# EasyEDA Pro project 限位开关转接板.eprj

# Schematic 原理图

## Sheets
1 主控MCU: Board Name: esp32; Create Date: 2024-04-22; Page Name: 主控MCU; Project Name: 3轴6.1--esp32; Schematic Name: 原理图; Update Date: 2025-05-09; Company: 嘉立创EDA; Page Size: A3; Version: V1.0
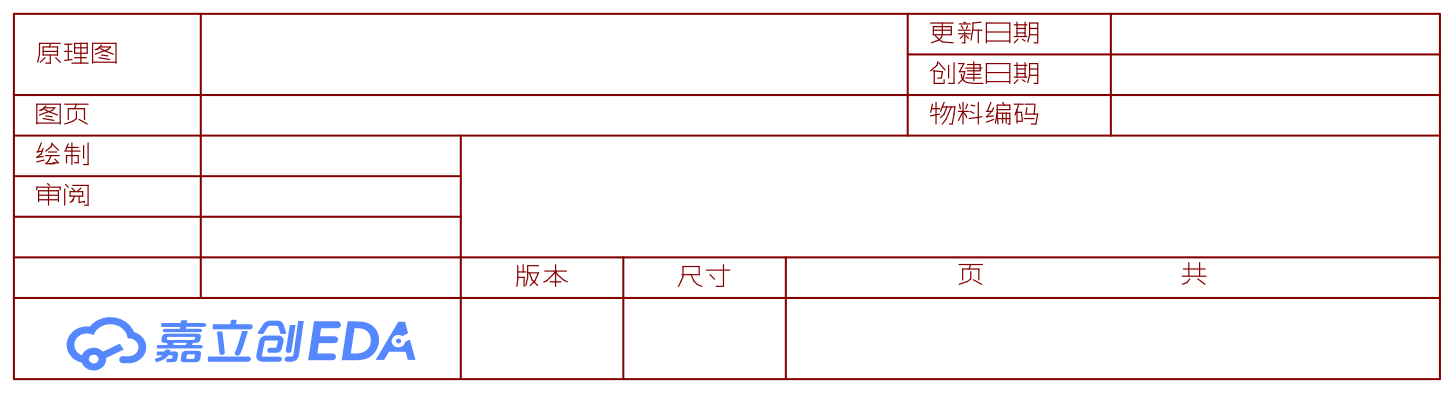
[diagram p0: 主控MCU]
2 电源: Create Date: 2025-05-14; Page Name: 电源; Update Date: 2025-05-14
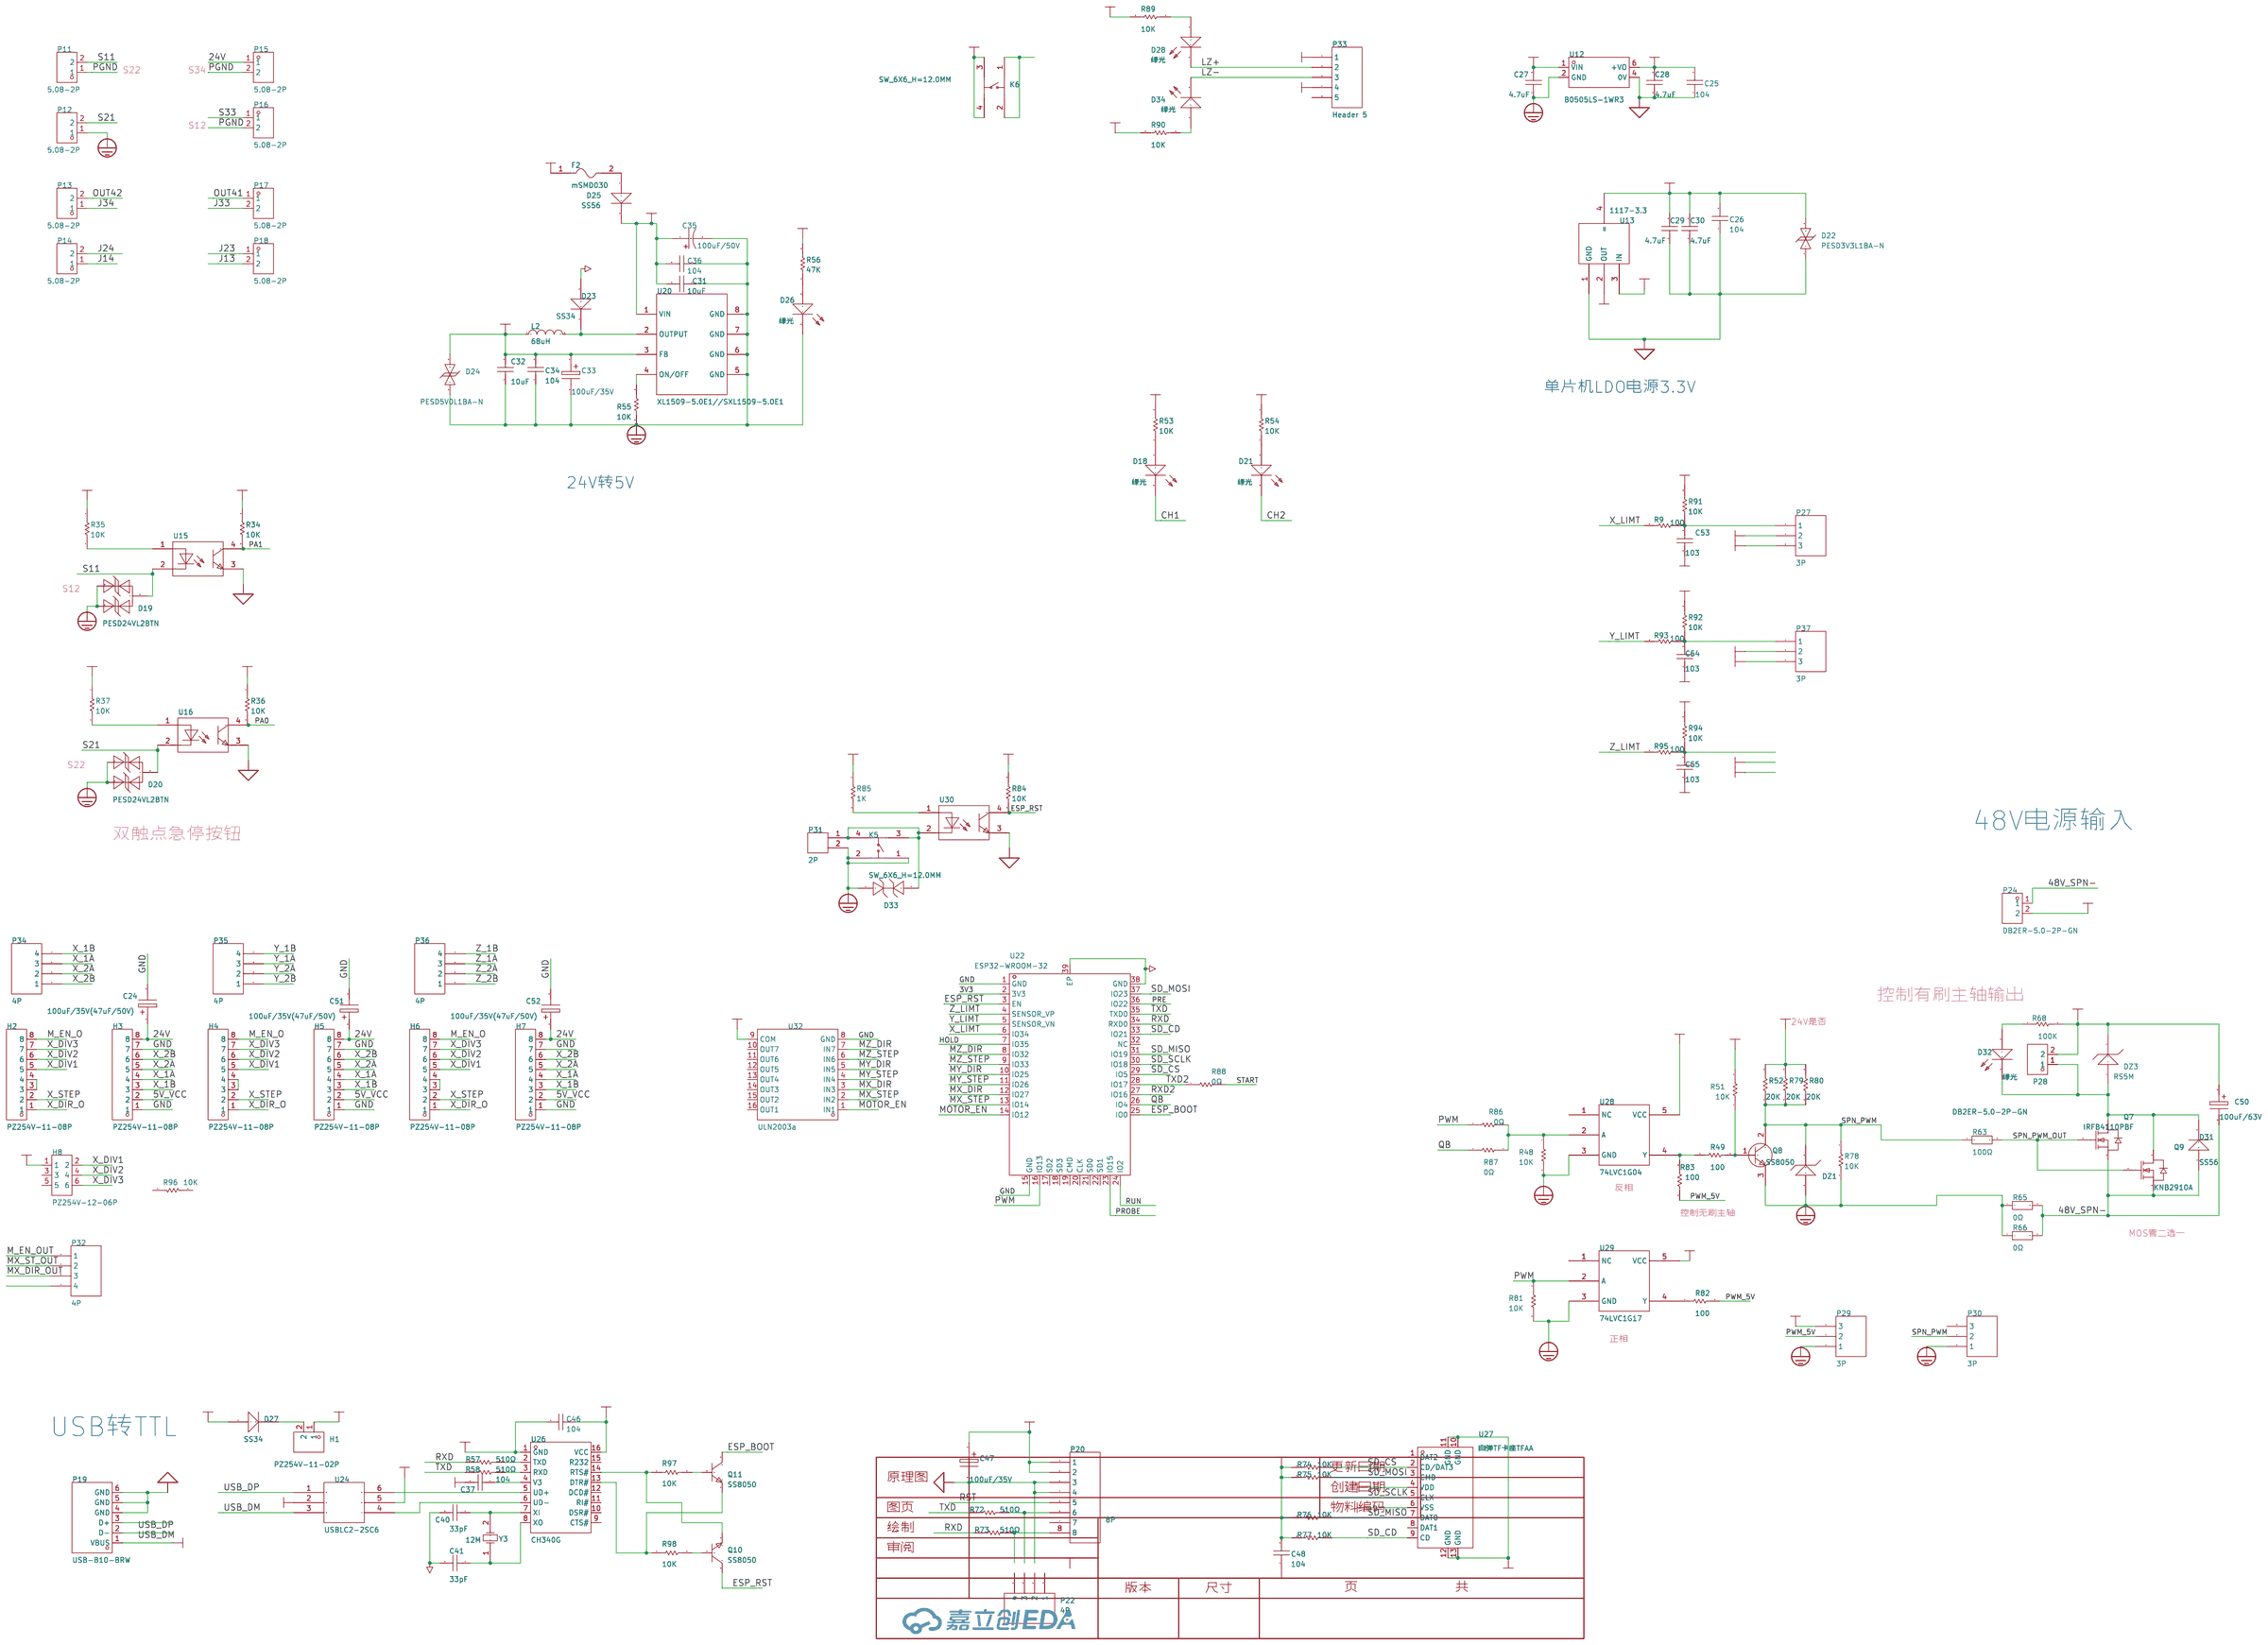
[diagram p1: 电源]

## Parts
C24  100uF/35V(47uF/50V)  [电解电容贴片6X6]
C25  104  [C0603]
C26  104  [0603C]
C27  4.7uF  [C1206]
C28  4.7uF  [C1206]
C29  4.7uF  [C1206]
C30  4.7uF  [C1206]
C31  10uF  [C1206]
C32  10uF  [C1206]
C33  100uF/35V  [电解电容贴片6X6]
C34  104  [0603C]
C35  100uF/50V  [CAP-SMD_BD10.0-L10.3-W10.3-LS11.0-R-RD]
C36  104  [0603C]
C37  104  [0603C]
C40  18pF  [0603C]
C41  18pF  [0603C]
C46  104  [0603C]
C47  100uF/35V  [电解电容贴片6X6]
C48  104  [11]
C50  100uF/63V  [电解电容贴片10x10]
C51  100uF/35V(47uF/50V)  [电解电容贴片6X6]
C52  100uF/35V(47uF/50V)  [电解电容贴片6X6]
C53  103  [11]
C54  103  [11]
C55  103  [11]
D18  绿光  [0603LED]
D19  PESD24VL2BTN  [SOT-23-3_L2.9-W1.6-P1.90-LS2.8-BR]
D20  PESD24VL2BTN  [SOT-23-3_L2.9-W1.6-P1.90-LS2.8-BR]
D21  绿光  [0603LED]
D22  PESD3V3L1BA-N  [SOD-323_L1.8-W1.3-LS2.5-BI]
D23  SS34  [SMA]
D24  PESD5V0L1BA-N  [SOD-323_L1.8-W1.3-LS2.5-BI]
D25  SS56  [SMA]
D26  绿光  [0603LED]
D27  SS34  [SMA]
D28  绿光  [0603LED]
D31  SS56  [SMA]
D32  绿光  [0603LED]
D33  ESD05V52D-C  [SOD-523_L1.2-W0.8-LS1.6-BI]
D34  绿光  [0603LED]
DZ1  --ѹ------SMAZ10V  [SMA]
DZ3  RS5M  [SMC]
F2  mSMD030  [F1812]
H1  PZ254V-11-02P  [HDR-TH_2P-P2.54-V-M]
H2  PZ254V-11-08P  [HDR-TH_8P-P2.54-V-M]
H3  PZ254V-11-08P  [HDR-TH_8P-P2.54-V-M]
H4  PZ254V-11-08P  [HDR-TH_8P-P2.54-V-M]
H5  PZ254V-11-08P  [HDR-TH_8P-P2.54-V-M]
H6  PZ254V-11-08P  [HDR-TH_8P-P2.54-V-M]
H7  PZ254V-11-08P  [HDR-TH_8P-P2.54-V-M]
H8  PZ254V-12-06P  [HDR-TH_PZ254V-12-06P-A40]
K5  SW_6X6_H=12.0MM  [KEY-SMD_4P-L6.0-W6.0-P4.50-LS9.0]
K6  SW_6X6_H=12.0MM  [KEY-SMD_4P-L6.0-W6.0-P4.50-LS9.0]
L2  68uH  [IND-SMD_L7.0-W7.0_SMDRI74-330MT]
P11  5.08-2P  [CONN-TH_2P-P5.08_DB128L-5.08-2P]
P12  5.08-2P  [CONN-TH_2P-P5.08_DB128L-5.08-2P]
P13  5.08-2P  [CONN-TH_2P-P5.08_DB128L-5.08-2P]
P14  5.08-2P  [CONN-TH_2P-P5.08_DB128L-5.08-2P]
P15  5.08-2P  [CONN-TH_2P-P5.08_DB128L-5.08-2P]
P16  5.08-2P  [CONN-TH_2P-P5.08_DB128L-5.08-2P]
P17  5.08-2P  [CONN-TH_2P-P5.08_DB128L-5.08-2P]
P18  5.08-2P  [CONN-TH_2P-P5.08_DB128L-5.08-2P]
P19  USB-B10-BRW  [USB-B-TH_USB-B10-BRW]
P20  8P  [IDC8]
P22  4P  [HDR1X4_CON]
P24  DB2ER-5.0-2P-GN  [CONN-TH_2P-P5.00_DB2ER-5.0-2P-GN]
P27  3P  [HDR1X3_CON]
P28  DB2ER-5.0-2P-GN  [CONN-TH_2P-P5.00_DB2ER-5.0-2P-GN]
P29  3P  [HDR1X3_CON]
P30  3P  [HDR1X3_CON]
P31  2P  [HDR1X2_CON]
P32  4P  [HDR1X4_CON]
P33  Header 5  [HDR1X5_CON]
P34  4P  [HDR1X4_CON]
P35  4P  [HDR1X4_CON]
P36  4P  [HDR1X4_CON]
P37  3P  [HDR1X3_CON]
Q7  IRFB4110PBF  [TO-220-3_L10.0-W4.5-P2.54-L]
Q8  SS8050  [SOT-23]
Q9  KNB2910A  [TO-263-2_L10.0-W9.1-P5.08-LS15.2-TL]
Q10  SS8050  [SOT-23-3_L2.9-W1.3-P1.90-LS2.4-BR]
Q11  SS8050  [SOT-23-3_L2.9-W1.3-P1.90-LS2.4-BR]
R9  100  [10]
R34  10K  [0603R]
R35  10K  [0603R]
R36  10K  [0603R]
R37  10K  [0603R]
R48  10K  [0603R]
R49  100  [0603R]
R51  10K  [0603R]
R52  20K  [0603R]
R53  10K  [0603R]
R54  10K  [0603R]
R55  10K  [0603R]
R56  47K  [0603R]
R57  510Ω  [0603R]
R58  510Ω  [0603R]
R63  100Ω  [R0603]
R65  0Ω  [R1210]
R66  0Ω  [R1210]
R68  100K  [0603R]
R72  510Ω  [0603R]
R73  510Ω  [0603R]
R74  10K  [10]
R75  10K  [10]
R76  10K  [10]
R77  10K  [10]
R78  10K  [0603R]
R79  20K  [0603R]
R80  20K  [0603R]
R81  10K  [0603R]
R82  100  [0603R]
R83  100  [0603R]
R84  10K  [0603R]
R85  1K  [0603R]
R86  0Ω  [0603R]
R87  0Ω  [0603R]
R88  0Ω  [0603R]
R89  10K  [0603R]
R90  10K  [0603R]
R91  10K  [10]
R92  10K  [10]
R93  100  [10]
R94  10K  [10]
R95  100  [10]
R96  10K  [0603R]
R97  10K  [0603R]
R98  10K  [0603R]
U12  B0505LS-1WR3  [PWRM-TH_BXXXXLS-1WR3]
U13  1117-3.3  [SOT-223]
U15  LTV-357T-C  [SOP-4_L4.4-W3.9-P2.54-LS7.0-TL]
U16  LTV-357T-C  [SOP-4_L4.4-W3.9-P2.54-LS7.0-TL]
U20  XL1509-5.0E1//SXL1509-5.0E1  [ESOP-8_L4.9-W3.9-P1.27-LS6.0-BL-EP]
U22  ESP32-WROOM-32  [WIFI-SMD_ESP32-WROOM-32UE-A]
U24  USBLC2-2SC6  [SOT-23-6]
U26  CH340G  [SOIC-16_L9.9-W3.9-P1.27-LS6.0-BL]
U27  自弹TF卡座TFAA  [SIM-SMD_C9900015645]
U28  74LVC1G04  [SOT-23-5]
U29  74LVC1G17  [SOT-23-5]
U30  LTV-357T-C  [SOP-4_L4.4-W3.9-P2.54-LS7.0-TL]
U32  ULN2003a  [SOP-16_L9.9-W3.9-P1.27-LS6.0-BL]
Y3  12M  [晶振贴片49SSMD]

## Library data of the parts
C24 C33 C47 C51 C52 = 100uF/35V: Origin Footprint 2: X47U; Origin Footprint 1: 电解电容贴片6x6; Design Item ID: ELECTRO1; Library Name: *
C25 C27-C32 = 104: Design Item ID: CAP; Library Name: SCH--װ--
C26 C34 C36 = 104: Capacitor (Semiconductor SIM Model); Published: 8-Jun-2000; LatestRevisionDate: 17-Jul-2002; LatestRevisionNote: Re-released for DXP Platform.; PackageReference: C1206; Publisher: Altium Limited; Origin Footprint 2: C1206; Origin Footprint 3: 0402; Origin Footprint 4: 1310[0504]; Origin Footprint 5: 1608[0603]; Origin Footprint 6: C1210; Origin Footprint 7: C0805; Origin Footprint 8: C1206; Origin Footprint 9: 0805; Origin Footprint 10: 0805L; Design Item ID: Cap Semi; Library Name: Miscellaneous Devices
C35 = VZH101M1HTR-1008: LCSC Part Name: 100uF ±20% 50V; Supplier Part: C311620; Manufacturer: lelon(立隆); Supplier Footprint: SMD,D10xL7.7mm; JLCPCB Part Class: Extended Part; Datasheet: https://atta.szlcsc.com/upload/public/pdf/source/20180930/C311620_91C90B34A3C1D0C3FD03CD260156F5F6.pdf; Supplier: LCSC; Tolerance: ±20%; Rated Voltage: 50V; φD: 10mm; L: 7.7mm; Lifetime @ Temp: 2000hrs@105℃; Operating Temperature: -45℃~+105℃
C37 = 104: Capacitor (Semiconductor SIM Model); Published: 8-Jun-2000; LatestRevisionDate: 17-Jul-2002; LatestRevisionNote: Re-released for DXP Platform.; PackageReference: C1206; Publisher: Altium Limited; Origin Footprint 2: C1206; Origin Footprint 3: 0402; Origin Footprint 4: 1310[0504]; Origin Footprint 5: 1608[0603]; Origin Footprint 6: C1210; Origin Footprint 7: C0805; Origin Footprint 8: C1206; Origin Footprint 9: 0805; Origin Footprint 10: 0805L; Origin Footprint 11: 0805C; Design Item ID: Cap Semi; Library Name: Miscellaneous Devices
C40 C41 = 33pF: Capacitor (Semiconductor SIM Model); Published: 8-Jun-2000; LatestRevisionDate: 17-Jul-2002; LatestRevisionNote: Re-released for DXP Platform.; PackageReference: C1206; Publisher: Altium Limited; Origin Footprint 2: C1206; Origin Footprint 3: 0402; Origin Footprint 4: 1310[0504]; Origin Footprint 5: 1608[0603]; Origin Footprint 6: C1210; Origin Footprint 7: C0805; Origin Footprint 8: C1206; Origin Footprint 9: 0805; Origin Footprint 10: 0805L; Design Item ID: Cap Semi; Library Name: Miscellaneous Devices
C46 = 103: Capacitor (Semiconductor SIM Model); Published: 8-Jun-2000; LatestRevisionDate: 17-Jul-2002; LatestRevisionNote: Re-released for DXP Platform.; PackageReference: C1206; Publisher: Altium Limited; Origin Footprint 2: C1206; Origin Footprint 3: 0402; Origin Footprint 4: 1310[0504]; Origin Footprint 5: 1608[0603]; Origin Footprint 6: C1210; Origin Footprint 7: C0805; Origin Footprint 8: C1206; Origin Footprint 9: 0805; Origin Footprint 10: 0805L; Design Item ID: Cap Semi; Library Name: Miscellaneous Devices
C48 = 104: Capacitor (Semiconductor SIM Model); Published: 8-Jun-2000; LatestRevisionDate: 17-Jul-2002; LatestRevisionNote: Re-released for DXP Platform.; PackageReference: C1206; Publisher: Altium Limited; Origin Footprint 2: C1206; Origin Footprint 3: 0402; Origin Footprint 4: 1310[0504]; Origin Footprint 5: 1608[0603]; Origin Footprint 6: C1210; Origin Footprint 7: C0805; Origin Footprint 8: C1206; Origin Footprint 9: 0805; Origin Footprint 10: 0805L; Origin Footprint 11: 0805C; Origin Footprint 1: 0603C; Design Item ID: Cap Semi; Library Name: Miscellaneous Devices
C50 = 100uF/63V: Origin Footprint 2: X47U; Design Item ID: ELECTRO1; Library Name: *
C53-C55 = 103: Design Item ID: CAP; Library Name: SCH封装库
D18 D21 D26 D32 = 绿光: Origin Footprint 2: LED(小); Design Item ID: LED; Library Name: SCH封装库
D19 D20 = PESD24VL2BTN: Supplier Part: C314266; Manufacturer: BORN伯恩半导体; Supplier Footprint: SOT-23; JLCPCB Part Class: Extended Part; Datasheet: https://atta.szlcsc.com/upload/public/pdf/source/20181015/C314266_827961A24CE19193E9C29A410C67A84F.pdf; Supplier: LCSC; Polarity: Bidirectional; Voltage - Reverse Standoff (Typ): 24V (Max); Voltage - Breakdown (Min): 26.7V; Voltage - Clamping (Max) @ Ipp: 48V; Current - Peak Pulse (10/1000μs): 6A (8/20us)
D22 D24 = PESD5V0S1BBN: 极性:Bidirectional;反向关断电压（典型值）:5V (Max);击穿电压（最小值）:6V;箝位电压:15V;峰值脉冲电流（10/1000us）:5A (8/20us);; Supplier Part: C314264; Manufacturer: BORN伯恩半导体; Supplier Footprint: SOD-523; JLCPCB Part Class: Extended Part; Datasheet: https://atta.szlcsc.com/upload/public/pdf/source/20181015/C314264_F9AC5761AC2631DA841FBD1D9C6821E3.pdf; Supplier: LCSC; Polarity: Bidirectional; Voltage - Reverse Standoff (Typ): 5V (Max); Voltage - Breakdown (Min): 6V; Voltage - Clamping (Max) @ Ipp: 15V; Current - Peak Pulse (10/1000μs): 5A (8/20us)
D23 D31 = SS56: Design Item ID: 1N4148; Library Name: SCH--װ--
D25 D27 = SS56: Design Item ID: 1N4148; Library Name: SCH封装库
D28 D34 = 红光: Origin Footprint 2: LED(小); Design Item ID: LED; Library Name: SCH封装库
D33 = ESD05V52D-C: 极性：双向 反向截止电压(Vrwm)：5V 击穿电压(VBR)：5.6V 钳位电压(Vc)@Ipp：15V 反向截止电压(Vrwm)：5V 击穿电压(最小值)：5.6V 峰值脉冲电流(Ipp)@tp=8/20μs：5A 最大钳位电压：15V; Supplier Part: C727170; Manufacturer: TWGMC(台湾迪嘉); Supplier Footprint: SOD-523; JLCPCB Part Class: 扩展库; Datasheet: https://atta.szlcsc.com/upload/public/pdf/source/20200827/C727170_700AFDE065FF081A69A0C04747B3686A.pdf; Supplier: LCSC
DZ1 = ��ѹ������SMAZ10V: Design Item ID: --ѹ------; Library Name: SCH--װ--
DZ3 = ��ָ�������RS2M: Design Item ID: --ѹ------; Library Name: SCH--װ--
F2 = mSMD030: 最大电压:30V;最大电流:100A;保持电流:300mA;跳闸电流:600mA;; LCSC Part Name: 0.3A  30V 自恢复保险丝; Supplier Part: C18331; Manufacturer: 台湾陆海; Supplier Footprint: 1812; JLCPCB Part Class: Extended Part; Datasheet: https://atta.szlcsc.com/upload/public/pdf/source/20160331/1459396375099.pdf; Supplier: LCSC; Operating Voltage (Max): 30V; Current Rating (Max): 100A; Hold Current: 300mA; Trip Current: 600mA
H1 = PZ254V-11-02P: 插针结构:1x2P;间距:2.54mm;行距:-;圆针/方针:方针;安装类型:直插;排数:单排;总PIN位数:2P;额定电流:-;额定电压:-;配合针长度:6mm;塑高:2.5mm;端接针长度:3mm;触头材质:黄铜;触头镀层:-;工作温度范围:-40℃~+105℃;颜色:黑色;; LCSC Part Name: 间距:2.54mm 1x2P 直插 方针; Supplier Part: C492401; Manufacturer: XFCN(兴飞); Supplier Footprint: 插件,P=2.54mm; JLCPCB Part Class: 扩展库; Datasheet: https://atta.szlcsc.com/upload/public/pdf/source/20200309/C492401_A812433581A9B211A7FFA413ADDFF0E5.pdf; Supplier: LCSC; Pin Structure: 1x2P; Pitch: 2.54mm; Circluar Pins/Square Pins: 方针; Mounting Type: 直插; Number of Rows: 单排; Number of Pins: 2P; Length of Mating Pin: 6mm; Insulation Height: 2.5mm; Length of End Connection Pin: 3mm; Contact Material: 黄铜; Operating Temperature Range: -40℃~+105℃; Color: 黑色
H2-H7 = PZ254V-11-08P: LCSC Part Name: 间距:2.54mm 1x8P 直插 方针; Supplier Part: C492407; Manufacturer: XFCN(兴飞); Supplier Footprint: 插件,P=2.54mm; JLCPCB Part Class: 扩展库; Datasheet: https://atta.szlcsc.com/upload/public/pdf/source/20200309/C492407_83A6FB26A2233368EDB9516968EC6149.pdf; Supplier: LCSC; Pin Structure: 1x8P; Pitch: 2.54mm; Circluar Pins/Square Pins: 方针; Mounting Type: 直插; Number of Rows: 单排; Number of Pins: 8P; Length of Mating Pin: 6mm; Insulation Height: 2.5mm; Length of End Connection Pin: 3mm; Contact Material: 黄铜; Operating Temperature Range: -40℃~+105℃; Color: 黑色
H8 = PZ254V-12-06P-A40: LCSC Part Name: 排针2.54mm间距 直插 2x03位 直针外露4mm; Supplier Part: C45384661; Manufacturer: XFCN(兴飞); Supplier Footprint: 插件,P=2.54mm; Datasheet: https://atta.szlcsc.com/upload/public/pdf/source/20250224/DF63EC05642BAFA253D2300DF133B397.pdf; Supplier: LCSC
K5 K6 = SW_6X6_H=12.0MM: Supplier Part: C9900018802; Supplier Footprint: KEY-SMD; JLCPCB Part Class: 扩展库; Supplier: LCSC
L2 = SMDRI74-330MT: 电感值:33uH;精度:±20%;额定电流:960mA;饱和电流(Isat):1.8A;类型:屏蔽电感;; LCSC Part Name: 33uH±20%1.8A; Supplier Part: C49625; Manufacturer: SXN(顺翔诺); Supplier Footprint: SMD,7.5x7.5mm; JLCPCB Part Class: 扩展库; Datasheet: https://atta.szlcsc.com/upload/public/pdf/source/20210810/6F96FDC19AA308DD2AD166FFB9640E87.pdf; Supplier: LCSC; Tolerance: ±20%; Rated Current: 960mA; Saturation Current (Isat): 1.8A; DC Resistance (DCR): 170mΩ; Type: 屏蔽电感
P11-P18 = DB128L-5.08-2P-GN-S: LCSC Part Name: 5.08mm 排数:1 每排P数:2 直针; Supplier Part: C395868; Manufacturer: DIBO(地博电气); Supplier Footprint: P=5.08mm; JLCPCB Part Class: Extended Part; Datasheet: https://atta.szlcsc.com/upload/public/pdf/source/20190611/C395868_9F3E17C88C37076AB29EAFE95D0B378F.pdf; Supplier: LCSC; Pitch: 5.08mm; Number of Rows: 1; Number of PINs Per Row: 2; Mounting Style: 直针; Current Rating (Max): 18A; Voltage Rating (Max): 250V; Wire Gauge - AWG: 12~30; Wire Gauge - mm?: 2.5; Operating Temperature Range: -40℃~+105℃; Color: 绿色
P19 = USB-B10-BRW: 连接器类型:Type-B;标准:USB 2.0;公母:母;端口数量:1;触点数量:4P;安装方式:弯插;额定电流 - 电源:1.5A;工作温度范围:-20℃~+70℃;焊接温度(最大值):260℃;; LCSC Part Name: Type-B母弯插; Supplier Part: C720549; Manufacturer: XUNPU(讯普); Supplier Footprint: 插件; JLCPCB Part Class: 扩展库; Datasheet: https://atta.szlcsc.com/upload/public/pdf/source/20200812/C720549_53E9294752E2933874870440E626C579.pdf; Supplier: LCSC; Connector Type: Type-B; Standard: USB2.0; Gender: 母; Number of Ports: 1; Number of Contacts: 4P; Mounting Style: 弯插; Current Rating - Power (Max): 1.5A; Operating Temperature Range: -20℃~+70℃; Soldering Temperature(Max): 260℃
P20 = 8P: Library Name: SCH封装库
P22 P32 P34-P36 = 4P: Library Name: SCH封装库
P24 P28 = DB2ER-5.0-2P-GN: 间距:5mm;颜色:绿色;排数:1;每排PIN数:2;额定电流:15A;额定电压:630V;触头镀层:锡;; LCSC Part Name: 5mm排数:1每排P数:2; Supplier Part: C5454428; Manufacturer: DORABO(地博电气); Supplier Footprint: P=5mm; JLCPCB Part Class: 扩展库; Datasheet: https://atta.szlcsc.com/upload/public/pdf/source/20230427/39CC0BD2D36F5E0FC60100946C6C8B3A.pdf; Supplier: LCSC; Pitch: 5mm; Color: 绿色; Number of Pins: 2P; Number of Rows: 1; Number of PINs Per Row: 2; Current Rating (Max): 15A; Voltage Rating (Max): 630V; Contact Plating: 锡
P27 P29 P30 P37 = 3P: Library Name: SCH封装库
P31 = 2P: Library Name: SCH--װ--
P33 = Header 5: Header, 5-Pin; LatestRevisionDate: 17-Jul-2002; LatestRevisionNote: Re-released for DXP Platform.; Publisher: Altium Limited; Library Name: Miscellaneous Connectors
Q7 = IRFB4110PBF: 类型:1个N沟道;漏源电压(Vdss):100V;连续漏极电流(Id):180A;导通电阻(RDS(on)@Vgs,Id):4.5mΩ@10V,75A;功率(Pd):370W;阈值电压(Vgs(th)@Id):4V@250uA;; LCSC Part Name: 1个N沟道 耐压:100V 电流:180A; Supplier Part: C2650; Manufacturer: Infineon(英飞凌); Supplier Footprint: TO-220; JLCPCB Part Class: 扩展库; Datasheet: https://atta.szlcsc.com/upload/public/pdf/source/20140820/1457707230776.pdf; Supplier: LCSC; Type: 1个N沟道; Drain Source Voltage (Vdss): 100V; Continuous Drain Current (Id): 180A; Drain Source On Resistance (RDS(on)@Vgs,Id): 4.5mΩ@10V,75A; Power Dissipation (Pd): 370W; Gate Threshold Voltage (Vgs(th)@Id): 4V@250uA; Total Gate Charge (Qg@Vgs): 210nC; Input Capacitance (Ciss@Vds): 9.62nF; Reverse Transfer Capacitance (Crss@Vds): 250pF; Operating Temperature: -55℃~+175℃
Q8 = SS8050: Published: 8-Jun-2000; LatestRevisionDate: 17-Jul-2002; LatestRevisionNote: Re-released for DXP Platform.; PackageReference: TO-226; Publisher: Altium Limited; Code_JEDEC: TO-226-AA; Origin Footprint 2: TO-92; Design Item ID: NPN; Library Name: SCH--װ--
Q9 = KNB2910A: LCSC Part Name: 1个N沟道 耐压:100V 电流:130A; Supplier Part: C176890; Manufacturer: KIA; Supplier Footprint: TO-263-2; JLCPCB Part Class: 扩展库; Datasheet: https://atta.szlcsc.com/upload/public/pdf/source/20180125/C176890_15168702140711304865.pdf; Supplier: LCSC; Drain to Source Voltage: 100V; Current - Continuous Drain(Id): 130A; RDS(on): 9mΩ@70V,10A; Pd - Power Dissipation: 300W; Gate Threshold Voltage (Vgs(th)@Id): 4V
Q10 Q11 = SS8050: LCSC Part Name: NPN 25V 1.5A 120-400 SOT-23; Supplier Part: C2931717; Manufacturer: Doeshare(德芯); Supplier Footprint: SOT-23; JLCPCB Part Class: 扩展库; Datasheet: https://atta.szlcsc.com/upload/public/pdf/source/20220106/99F9A3DFCBDD91265C711555CE6390BF.pdf; Supplier: LCSC
R9 R93 R95 = 100: Resistor; Published: 8-Jun-2000; LatestRevisionDate: 17-Jul-2002; LatestRevisionNote: Re-released for DXP Platform.; PackageReference: AXIAL-0.3; Publisher: Altium Limited; Origin Footprint 2: AXIAL-0.3; Origin Footprint 3: R0805; Origin Footprint 4: 0805R; Origin Footprint 1: 0603R; Design Item ID: RES; Library Name: SCH封装库
R34 R36 R84 R97 R98 = 10K: Resistor; Published: 8-Jun-2000; LatestRevisionDate: 17-Jul-2002; LatestRevisionNote: Re-released for DXP Platform.; PackageReference: AXIAL-0.3; Publisher: Altium Limited; Origin Footprint 2: AXIAL-0.3; Origin Footprint 3: R0805; Origin Footprint 4: 0805R; Design Item ID: RES; Library Name: SCH封装库
R35 R37 R85 = 470Ω: Resistor; Published: 8-Jun-2000; LatestRevisionDate: 17-Jul-2002; LatestRevisionNote: Re-released for DXP Platform.; PackageReference: AXIAL-0.3; Publisher: Altium Limited; Origin Footprint 2: AXIAL-0.3; Origin Footprint 3: R0805; Origin Footprint 4: 0805R; Design Item ID: RES; Library Name: SCH封装库
R48 R51 R68 R78 R81 R96 = 10K: Resistor; Published: 8-Jun-2000; LatestRevisionDate: 17-Jul-2002; LatestRevisionNote: Re-released for DXP Platform.; PackageReference: AXIAL-0.3; Publisher: Altium Limited; Origin Footprint 2: AXIAL-0.3; Origin Footprint 3: R0805; Origin Footprint 4: 0805R; Design Item ID: RES; Library Name: SCH--װ--
R49 R82 R83 R86-R88 = 100: Resistor; Published: 8-Jun-2000; LatestRevisionDate: 17-Jul-2002; LatestRevisionNote: Re-released for DXP Platform.; PackageReference: AXIAL-0.3; Publisher: Altium Limited; Origin Footprint 2: AXIAL-0.3; Origin Footprint 3: R0805; Origin Footprint 4: 0805R; Design Item ID: RES; Library Name: SCH--װ--
R52 R79 R80 = 1K: Resistor; Published: 8-Jun-2000; LatestRevisionDate: 17-Jul-2002; LatestRevisionNote: Re-released for DXP Platform.; PackageReference: AXIAL-0.3; Publisher: Altium Limited; Origin Footprint 2: AXIAL-0.3; Origin Footprint 3: R0805; Origin Footprint 4: 0805R; Design Item ID: RES; Library Name: SCH--װ--
R53 R54 R56 R89 R90 = 1K: Resistor; Published: 8-Jun-2000; LatestRevisionDate: 17-Jul-2002; LatestRevisionNote: Re-released for DXP Platform.; PackageReference: AXIAL-0.3; Publisher: Altium Limited; Origin Footprint 2: AXIAL-0.3; Origin Footprint 3: R0805; Origin Footprint 4: 0805R; Design Item ID: RES; Library Name: SCH封装库
R55 = 10k: Resistor; Published: 8-Jun-2000; LatestRevisionDate: 17-Jul-2002; LatestRevisionNote: Re-released for DXP Platform.; PackageReference: AXIAL-0.3; Publisher: Altium Limited; Origin Footprint 2: AXIAL-0.3; Origin Footprint 3: R0805; Origin Footprint 4: 0805R; Design Item ID: RES; Library Name: SCH封装库
R57 R58 R72 R73 = 100: Resistor; Published: 8-Jun-2000; LatestRevisionDate: 17-Jul-2002; LatestRevisionNote: Re-released for DXP Platform.; PackageReference: AXIAL-0.3; Publisher: Altium Limited; Origin Footprint 2: AXIAL-0.3; Origin Footprint 3: R0805; Origin Footprint 4: 0805R; Design Item ID: RES; Library Name: SCH封装库
R63 = Res_0603: Supplier Footprint: 0603
R65 R66 = Res_1210: Supplier Footprint: 1210
R74-R77 R91 R92 R94 = 10K: Resistor; Published: 8-Jun-2000; LatestRevisionDate: 17-Jul-2002; LatestRevisionNote: Re-released for DXP Platform.; PackageReference: AXIAL-0.3; Publisher: Altium Limited; Origin Footprint 2: AXIAL-0.3; Origin Footprint 3: R0805; Origin Footprint 4: 0805R; Origin Footprint 1: 0603R; Design Item ID: RES; Library Name: SCH封装库
U12 = B0505LS-1WR3: 100%国产化器件，高可靠性，具备ROHS、REACH、CE认证产品; Supplier Part: C909800; Manufacturer: DEXU(德旭电子); Supplier Footprint: 插件; JLCPCB Part Class: 扩展库; Datasheet: https://atta.szlcsc.com/upload/public/pdf/source/20220506/97E51FF679E86FC18F266BBBBBA200F9.pdf; Supplier: LCSC; Number of channel: 1; input voltage (Vdc): 4.5V~5.5V; Output Voltage: 5V; Output Current (Max): 200mA
U13 = 1117-3.3: Design Item ID: LM1117; Library Name: Party600
U15 U16 U30 = LTV-357T-C: 输入电压类型:DC;正向电压:1.2V;输出电流:50mA;隔离电压(rms):3.75kV;反向电压:6V;接收端电压:35V;输出通道数:1;集射极饱和电压(Vce(sat)@Ic,IF):200mV@1mA,20mA;; Supplier: LCSC; Manufacturer: LITEON(光宝); Supplier Part: C119091; JLCPCB Part Class: 扩展库; LCSC Part Name: DC输入隔离电压(rms):3750V; Supplier Footprint: SOP-4-2.54mm; Datasheet: https://atta.szlcsc.com/upload/public/pdf/source/20170930/C133128_1506736380934997376.pdf; Input voltage type: DC; Output Type: 光电三极管; Forward Voltage: 1.2V; Output Current: 50mA; Isolation Voltage(rms): 3.75kV; Reverse Voltage: 6V; Receiving End Voltage: 35V; Number of Outputs: 1; Collector-Emitter Saturation Voltage (Vce(sat)@Ic,IF): 200mV@1mA,20mA; Rise time: 4us@2mA,100Ω; Fall time: 3us@2mA,100Ω; Operating Temperature: -55℃~+110℃
U20 = XL1509-5.0E1: 功能类型:降压型;同步整流:-;输出通道数:-;拓扑结构:-;输入电压:-;输出电流(最大值):-;开关频率:-;; LCSC Part Name: 降压型; Supplier Part: C61063; Manufacturer: XLSEMI(芯龙); Supplier Footprint: SOP-8_150mil; JLCPCB Part Class: Basic Part; Datasheet: https://atta.szlcsc.com/upload/public/pdf/source/20151020/1457707483545.pdf; Supplier: LCSC; Function: 降压型
U22 = ESP32-WROOM-32: Supplier Part: C95209; Manufacturer: ESPRESSIF(乐鑫); JLCPCB Part Class: 扩展库; Datasheet: https://atta.szlcsc.com/upload/public/pdf/source/20170925/C95209_1506321763821990573.pdf; Supplier: LCSC
U24 = USBLC2-2SC6: Design Item ID: DIP6; Library Name: SCH封装库
U26 = CH340G: 应用功能:收发器;接口协议:USB 2.0;数据速率:2Mbps;; LCSC Part Name: USB转串口芯片 CH340; Supplier Part: C14267; Manufacturer: WCH(南京沁恒); Supplier Footprint: SOP-16; JLCPCB Part Class: 扩展库; Datasheet: https://atta.szlcsc.com/upload/public/pdf/source/20230530/6E401E9554E9F5311886CC8B3F89B62E.pdf; Supplier: LCSC; Applications Function: 收发器; Protocol: USB 2.0; Supply Voltage: 3.3V；5V; Data Rate: 2Mbps
U27 = 自弹TF卡座TFAA: Supplier Part: C9900015645; Supplier Footprint: SMD; JLCPCB Part Class: 扩展库; Supplier: LCSC
U28 = 74LVC1G04: Design Item ID: 74LVC1G17; Library Name: SCH--װ--
U29 = 74LVC1G04: Library Name: SCH--װ--
U32 = ULN2003_C18164408: 通道数:七路;集射击穿电压(Vceo):50V;集电极电流(Ic):500mA;; LCSC Part Name: ULN2003; Supplier Part: C18164408; Manufacturer: GR(国睿); Supplier Footprint: SOP-16; JLCPCB Part Class: 扩展库; Datasheet: https://atta.szlcsc.com/upload/public/pdf/source/20230915/31D6968A1DB9572D6F2E183AA116B56A.pdf; Supplier: LCSC; number of channels: 七路; Maximum collector Emitter Voltage (Vceo): 50V; Collector Current(Ic): 500mA; maximum input voltage: 30V; Operating Temperature: -40℃~+85℃
Y3 = 12M: Crystal Oscillator; Published: 8-Jun-2000; LatestRevisionDate: 17-Jul-2002; LatestRevisionNote: Re-released for DXP Platform.; PackageReference: R38; Publisher: Altium Limited; Origin Footprint 2: R38; Origin Footprint 3: XTAL-49S; Design Item ID: XTAL; Library Name: Miscellaneous Devices

## Nets
3V3: C26.2 C29.2 C30.2 C48.2 D22.2 R34.1 R36.1 R53.2 R54.2 R74.2 R75.2 R76.2 R77.2 R84.1 U13.2(OUT) U13.4(=) U22.2(3V3) U27.4(VDD)
5V_MCU: C25.2 C28.2 U12.6(+VO) U13.3(IN)
5V_VCC: C27.2 C32.1 C33.1 C34.2 C46.1 C47.1 D24.2 H1.1 H3.2 H5.2 H7.2 H8.1 L2.1 P20.1 P20.2 P29.3 R51.2 R85.1 U12.1(VIN) U20.3(FB) U26.16(VCC) U28.5(VCC) U29.5(VCC) U32.9(COM)
12V: R52.2 R79.2 R80.2
24V: C24.1 C51.1 C52.1 F2.1 H3.8 H5.8 H7.8 P15.1
48V_SPN+: C50.1 DZ3.2 P24.2 P28.2 R68.2
48V_SPN-: C50.2 D31.1 P24.1 Q7.3(S) Q9.3(S) R65.2 R66.2
GND: C24.2 C37.2 C40.2 C41.2 C46.2 C47.2 C48.1 C51.2 C52.2 C53.1 C54.1 C55.1 D23.1 D33.1 DZ1.1 H3.1 H3.7 H5.1 H5.7 H7.1 H7.7 K5.1 K5.2 P19.4(GND) P19.5(GND) P19.6(GND) P20.3 P20.4 P27.2 P29.1 P30.1 P31.2 P33.1 P33.4 P37.2 Q8.3(E) R48.2 R65.1 R66.1 R78.2 R81.2 U22.1(GND) U22.15(GND) U22.38(GND) U22.39(EP) U24.2 U26.1(GND) U27.6(VSS) U27.10(GND) U27.11(GND) U27.12(GND) U27.13(GND) U28.3(GND) U29.3(GND) U30.3 U32.8(GND)
PGND: C27.1 C31.1 C32.2 C33.2 C34.1 C35.2 C36.1 D19.1(K) D19.2(K) D20.1(K) D20.2(K) D24.1 D26.2 P11.1 P12.1 P15.2 P16.2 R55.2 U12.2(GND) U20.5(GND) U20.6(GND) U20.7(GND) U20.8(GND)
SGND: C25.1 C26.1 C28.1 C29.1 C30.1 D22.1 U12.4(0V) U13.1(GND) U15.3 U16.3
VCC: K6.3 K6.4 P27.3 P37.3 R89.2 R90.2 R91.2 R92.2 R94.2
VIN_24V: C31.2 C35.1 C36.2 D25.2 R35.1 R37.1 R56.2 U20.1(VIN)
CH1: D18.2
CH2: D21.2
ESP_BOOT: Q11.3(C) U22.25(IO0)
ESP_RST: Q10.3(C) R84.2 U22.3(EN) U30.4
HOLD: U22.7(IO35)
J13: P18.2
J14: P14.1
J23: P18.1
J24: P14.2
J33: P17.2
J34: P13.1
LZ+: D28.2 P33.2
LZ-: D34.2 P33.3
M_EN_O: H2.8 H4.8 H6.8
M_EN_OUT: P32.1
MOTOR_EN: U22.14(IO12) U32.1(IN1)
MX_DIR: U22.12(IO27) U32.3(IN3)
MX_DIR_OUT: P32.3
MX_ST_OUT: P32.2
MX_STEP: U22.13(IO14) U32.2(IN2)
MY_DIR: U22.10(IO25) U32.5(IN5)
MY_STEP: U22.11(IO26) U32.4(IN4)
MZ_DIR: U22.8(IO32) U32.7(IN7)
MZ_STEP: U22.9(IO33) U32.6(IN6)
OUT41: P17.1
OUT42: P13.2
PA0: R36.2 U16.4
PA1: R34.2 U15.4
PRE: U22.36(IO22)
PROBE: U22.23(IO15)
PWM: R81.1 R86.1 U22.16(IO13) U29.2(A)
PWM_5V: P29.2 R82.2 R83.1
QB: R87.1 U22.26(IO4)
RST: P20.5
RUN: U22.24(IO2)
RXD: R57.2 R73.1 U22.34(RXD0)
RXD2: U22.27(IO16)
S11: D19.3(A) P11.2 U15.2
S21: D20.3(A) P12.2 U16.2
S33: P16.1
SD_CD: R77.1 U22.33(IO21) U27.9(CD)
SD_CS: R74.1 U22.29(IO5) U27.2(CD/DAT3)
SD_MISO: R76.1 U22.31(IO19) U27.7(DAT0)
SD_MOSI: R75.1 U22.37(IO23) U27.3(CMD)
SD_SCLK: U22.30(IO18) U27.5(CLX)
SPN_PWM: DZ1.2 P30.2 Q8.2(C) R52.1 R63.1 R78.1 R79.1 R80.1
SPN_PWM_OUT: Q7.1(G) Q9.1(G) R63.2
START: R88.2
TXD: R58.2 R72.1 U22.35(TXD0)
TXD2: R88.1 U22.28(IO17)
USB_DM: P19.2(D-) U24.3
USB_DP: P19.3(D+) U24.1
VUSB: D27.1 P19.1(VBUS) U24.5
X_1A: H3.4 H5.4 H7.4 P34.3
X_1B: H3.3 H5.3 H7.3 P34.4
X_2A: H3.5 H5.5 H7.5 P34.2
X_2B: H3.6 H5.6 H7.6 P34.1
X_DIR_O: H2.1 H4.1 H6.1
X_DIV1: H2.5 H4.5 H6.5 H8.2
X_DIV2: H2.6 H4.6 H6.6 H8.4
X_DIV3: H2.7 H4.7 H6.7 H8.6
X_LIMT: R9.2 U22.6(IO34)
X_STEP: H2.2 H4.2 H6.2
Y_1A: P35.3
Y_1B: P35.4
Y_2A: P35.2
Y_2B: P35.1
Y_LIMT: R93.2 U22.5(SENSOR_VN)
Z_1A: P36.3
Z_1B: P36.4
Z_2A: P36.2
Z_2B: P36.1
Z_LIMT: R95.2 U22.4(SENSOR_VP)
Net-(C37-1): C37.1 U26.4(V3)
Net-(C40-1): C40.1 U26.7(XI) Y3.2(OSC2)
Net-(C41-1): C41.1 U26.8(XO) Y3.1(OSC1)
Net-(C53-2): C53.2 P27.1 R9.1 R91.1
Net-(C54-2): C54.2 P37.1 R92.1 R93.1
Net-(C55-2): C55.2 R94.1 R95.1
Net-(D18-1): D18.1 R53.1
Net-(D21-1): D21.1 R54.1
Net-(D23-2): D23.2 L2.2 U20.2(OUTPUT)
Net-(D25-1): D25.1 F2.2
Net-(D26-1): D26.1 R56.1
Net-(D27-2): D27.2 H1.2
Net-(D28-1): D28.1 R89.1
Net-(D31-2): D31.2 D32.2 DZ3.1 P28.1 Q7.2(D) Q9.4(D)
Net-(D32-1): D32.1 R68.1
Net-(D33-2): D33.2 K5.3 K5.4 P31.1 U30.2
Net-(D34-1): D34.1 R90.1
Net-(H2-3): H2.3 H2.4
Net-(H4-3): H4.3 H4.4
Net-(H6-3): H6.3 H6.4
Net-(K6-1): K6.1 K6.2
Net-(P20-6): P20.6 R72.2
Net-(P20-8): P20.8 R73.2
Net-(Q8-1): Q8.1(B) R49.2 R51.1
Net-(Q10-1): Q10.1(B) R98.2
Net-(Q10-2): Q10.2(E) R97.1 U26.14(RTS#)
Net-(Q11-1): Q11.1(B) R97.2
Net-(Q11-2): Q11.2(E) R98.1 U26.13(DTR#)
Net-(R35-2): R35.2 U15.1
Net-(R37-2): R37.2 U16.1
Net-(R48-1): R48.1 R86.2 R87.2 U28.2(A)
Net-(R49-1): R49.1 R83.2 U28.4(Y)
Net-(R55-1): R55.1 U20.4(ON/OFF)
Net-(R57-1): R57.1 U26.2(TXD)
Net-(R58-1): R58.1 U26.3(RXD)
Net-(R82-1): R82.1 U29.4(Y)
Net-(R85-2): R85.2 U30.1
Net-(U24-4): U24.4 U26.6(UD-)
Net-(U24-6): U24.6 U26.5(UD+)

Not connected (* = marked no-connect by the designer): H8 3 5; P20 7; P22 1 2 3 4; P30 3; P32 4; P33 5; R96 1 2; U22 17(SD2) 18(SD3) 19(CMD) 20(CLK) 21(SD0) 22(SD1) 32(NC); U26 9(CTS#) 10(DSR#) 11(RI#) 12(DCD#) 15(R232); U27 1(DAT2) 8(DAT1); U28 1(NC); U29 1(NC); U32 10(OUT7) 11(OUT6) 12(OUT5) 13(OUT4) 14(OUT3) 15(OUT2) 16(OUT1)

## Notes on the sheets
sheet 2
- S22
- S34
- S12
- 单片机LDO电源3.3V
- 24V转5V
- S12
- S22
- 双触点急停按钮
- 48V电源输入
- 控制有刷主轴输出
- 24V是否
- 反相
- 控制无刷主轴
- MOS管二选一
- 正相
- USB转TTL
